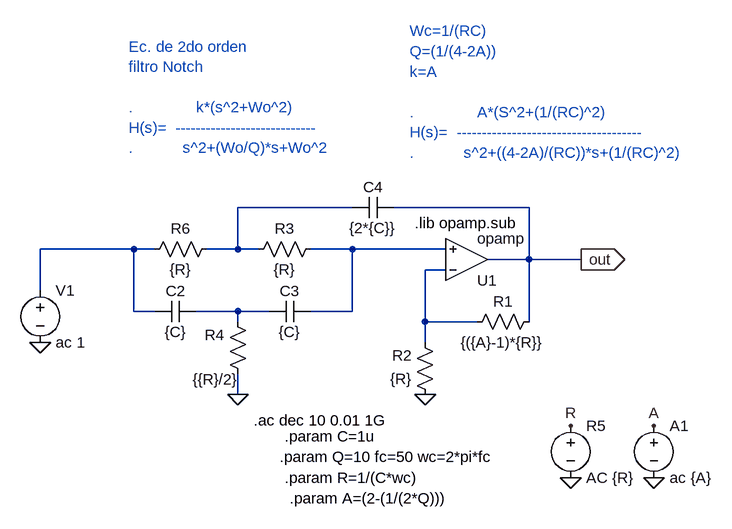
[diagram p0: schematic Notch.asc]
Notch.asc, the LTspice schematic file:
Version 4
SHEET 1 880 680
WIRE 192 -32 16 -32
WIRE 464 -32 256 -32
WIRE -144 32 -288 32
WIRE -112 32 -144 32
WIRE 16 32 16 -32
WIRE 16 32 -32 32
WIRE 48 32 16 32
WIRE 192 32 128 32
WIRE 336 32 192 32
WIRE 464 48 464 -32
WIRE 464 48 400 48
WIRE 544 48 464 48
WIRE 336 64 304 64
WIRE -288 96 -288 32
WIRE -144 128 -144 32
WIRE -112 128 -144 128
WIRE 16 128 -48 128
WIRE 64 128 16 128
WIRE 192 128 192 32
WIRE 192 128 128 128
WIRE 16 144 16 128
WIRE 304 144 304 64
WIRE 384 144 304 144
WIRE 464 144 464 48
WIRE 304 176 304 144
WIRE 16 256 16 224
FLAG 304 256 0
FLAG -288 176 0
FLAG 544 48 out
IOPIN 544 48 Out
FLAG 656 384 0
FLAG 528 384 0
FLAG 528 304 R
FLAG 656 304 A
FLAG 16 256 0
SYMBOL OpAmps\\opamp 368 112 M180
SYMATTR InstName U1
SYMATTR SpiceLine2 GBW=100Meg
SYMBOL res 480 128 R90
WINDOW 0 0 56 VBottom 2
WINDOW 3 32 56 VTop 2
SYMATTR InstName R1
SYMATTR Value {({A}-1)*{R}}
SYMBOL res 320 272 R180
WINDOW 0 36 76 Left 2
WINDOW 3 36 40 Left 2
SYMATTR InstName R2
SYMATTR Value {R}
SYMBOL res 32 240 R180
WINDOW 0 36 76 Left 2
WINDOW 3 15 7 Left 2
SYMATTR InstName R4
SYMATTR Value {{R}/2}
SYMBOL voltage -288 80 R0
WINDOW 123 0 0 Left 0
WINDOW 39 0 0 Left 0
SYMATTR InstName V1
SYMATTR Value ac 1
SYMBOL voltage 528 288 R0
SYMATTR InstName R5
SYMATTR Value AC {R}
SYMBOL voltage 656 288 R0
WINDOW 123 0 0 Left 0
WINDOW 39 0 0 Left 0
SYMATTR InstName A1
SYMATTR Value ac {A}
SYMBOL cap -48 112 R90
WINDOW 0 0 32 VBottom 2
WINDOW 3 32 32 VTop 2
SYMATTR InstName C2
SYMATTR Value {C}
SYMBOL res -16 16 R90
WINDOW 0 0 56 VBottom 2
WINDOW 3 32 56 VTop 2
SYMATTR InstName R6
SYMATTR Value {R}
SYMBOL cap 128 112 R90
WINDOW 0 0 32 VBottom 2
WINDOW 3 32 32 VTop 2
SYMATTR InstName C3
SYMATTR Value {C}
SYMBOL cap 256 -48 R90
WINDOW 0 0 32 VBottom 2
WINDOW 3 32 32 VTop 2
SYMATTR InstName C4
SYMATTR Value {2*{C}}
SYMBOL res 144 16 R90
WINDOW 0 0 56 VBottom 2
WINDOW 3 32 56 VTop 2
SYMATTR InstName R3
SYMATTR Value {R}
TEXT 288 -8 Left 2 !.lib opamp.sub
TEXT 280 -304 Left 2 ;Wc=1/(RC)\nQ=(1/(4-2A))\nk=A\n \n.              A*(S^2+(1/(RC)^2)\nH(s)=  -------------------------------------\n.           s^2+((4-2A)/(RC))*s+(1/(RC)^2)
TEXT -152 -280 Left 2 ;Ec. de 2do orden \nfiltro Notch\n \n.              k*(s^2+Wo^2)\nH(s)=  ----------------------------\n.           s^2+(Wo/Q)*s+Wo^2
TEXT 88 320 Left 2 !.param C=1u
TEXT 80 352 Left 2 !.param Q=10 fc=50 wc=2*pi*fc
TEXT 88 384 Left 2 !.param R=1/(C*wc)
TEXT 96 416 Left 2 !.param A=(2-(1/(2*Q)))
TEXT 40 296 Left 2 !.ac dec 10 0.01 1G

The netlist it stands for:
* Notch.asc
XU1 N004 N003 out opamp Aol=100K GBW=100Meg  ; pins invin noninvin out
R1 out N004 {({A}-1)*{R}}
R2 0 N004 {R}
R4 0 N005 {{R}/2}
V1 N002 0 ac 1
V§R5 R 0 AC {R}
V§A1 A 0 ac {A}
C2 N005 N002 {C}
R6 N001 N002 {R}
C3 N003 N005 {C}
C4 out N001 {2*{C}}
R3 N003 N001 {R}
.lib opamp.sub
* Wc=1/(RC)
* Q=(1/(4-2A))
* k=A
* .              A*(S^2+(1/(RC)^2)
* H(s)=  -------------------------------------
* .           s^2+((4-2A)/(RC))*s+(1/(RC)^2)
* Ec. de 2do orden
* filtro Notch
* .              k*(s^2+Wo^2)
* H(s)=  ----------------------------
* .           s^2+(Wo/Q)*s+Wo^2
.param C=1u
.param Q=10 fc=50 wc=2*pi*fc
.param R=1/(C*wc)
.param A=(2-(1/(2*Q)))
.ac dec 10 0.01 1G
.backanno
.end